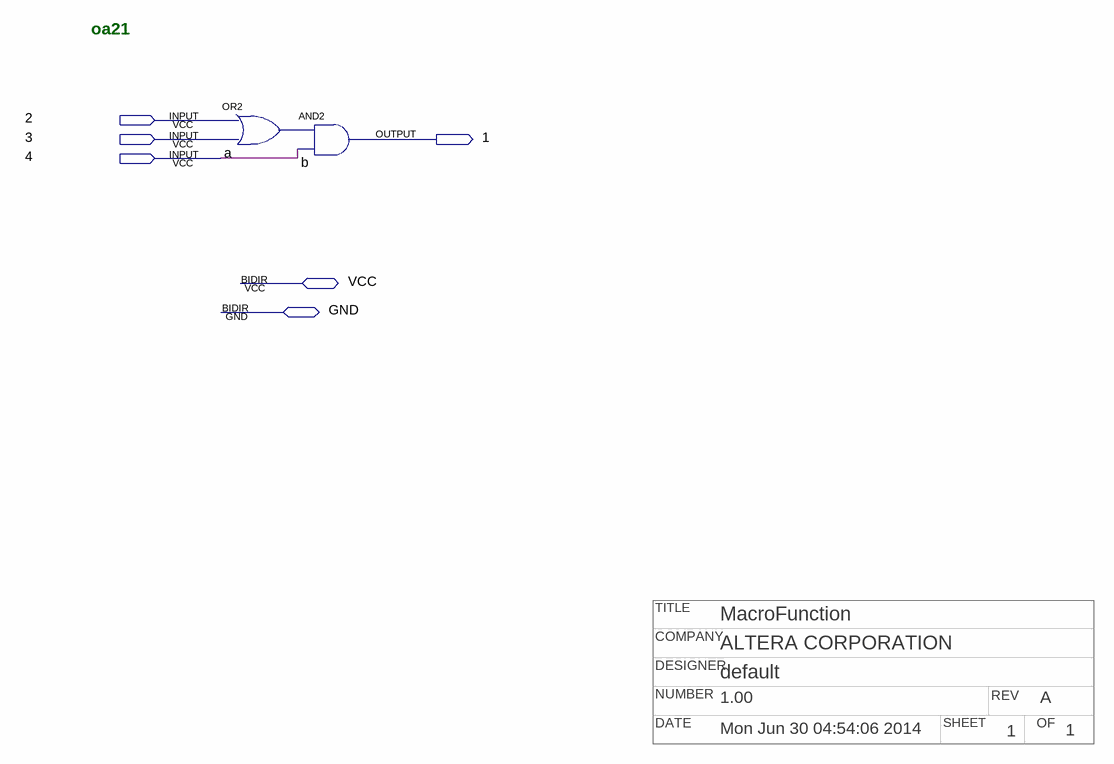
[diagram p0: schematic sheet]
// Quartus schematic npoa21.bdf as structural Verilog: 2 symbols, 6 pins
// Title block: TITLE: MacroFunction; COMPANY: ALTERA CORPORATION; DESIGNER: default; NUMBER: 1.00; REV: A; DATE: Mon Jun 30 04:54:06 2014; SHEET: 1; OF: 1
module npoa21 (
  input  \2 ,
  input  \3 ,
  input  \4 ,
  inout  VCC,
  inout  GND,
  output \1 
);

  wire a_out;

  or a (a_out, \2 , \3 );
  and b (\1 , a_out, \4 );

  // Notes on the sheet:
  //   oa21
endmodule
